# EAGLE schematic outin_shield_ichigojam (EAGLE 7.4.0)
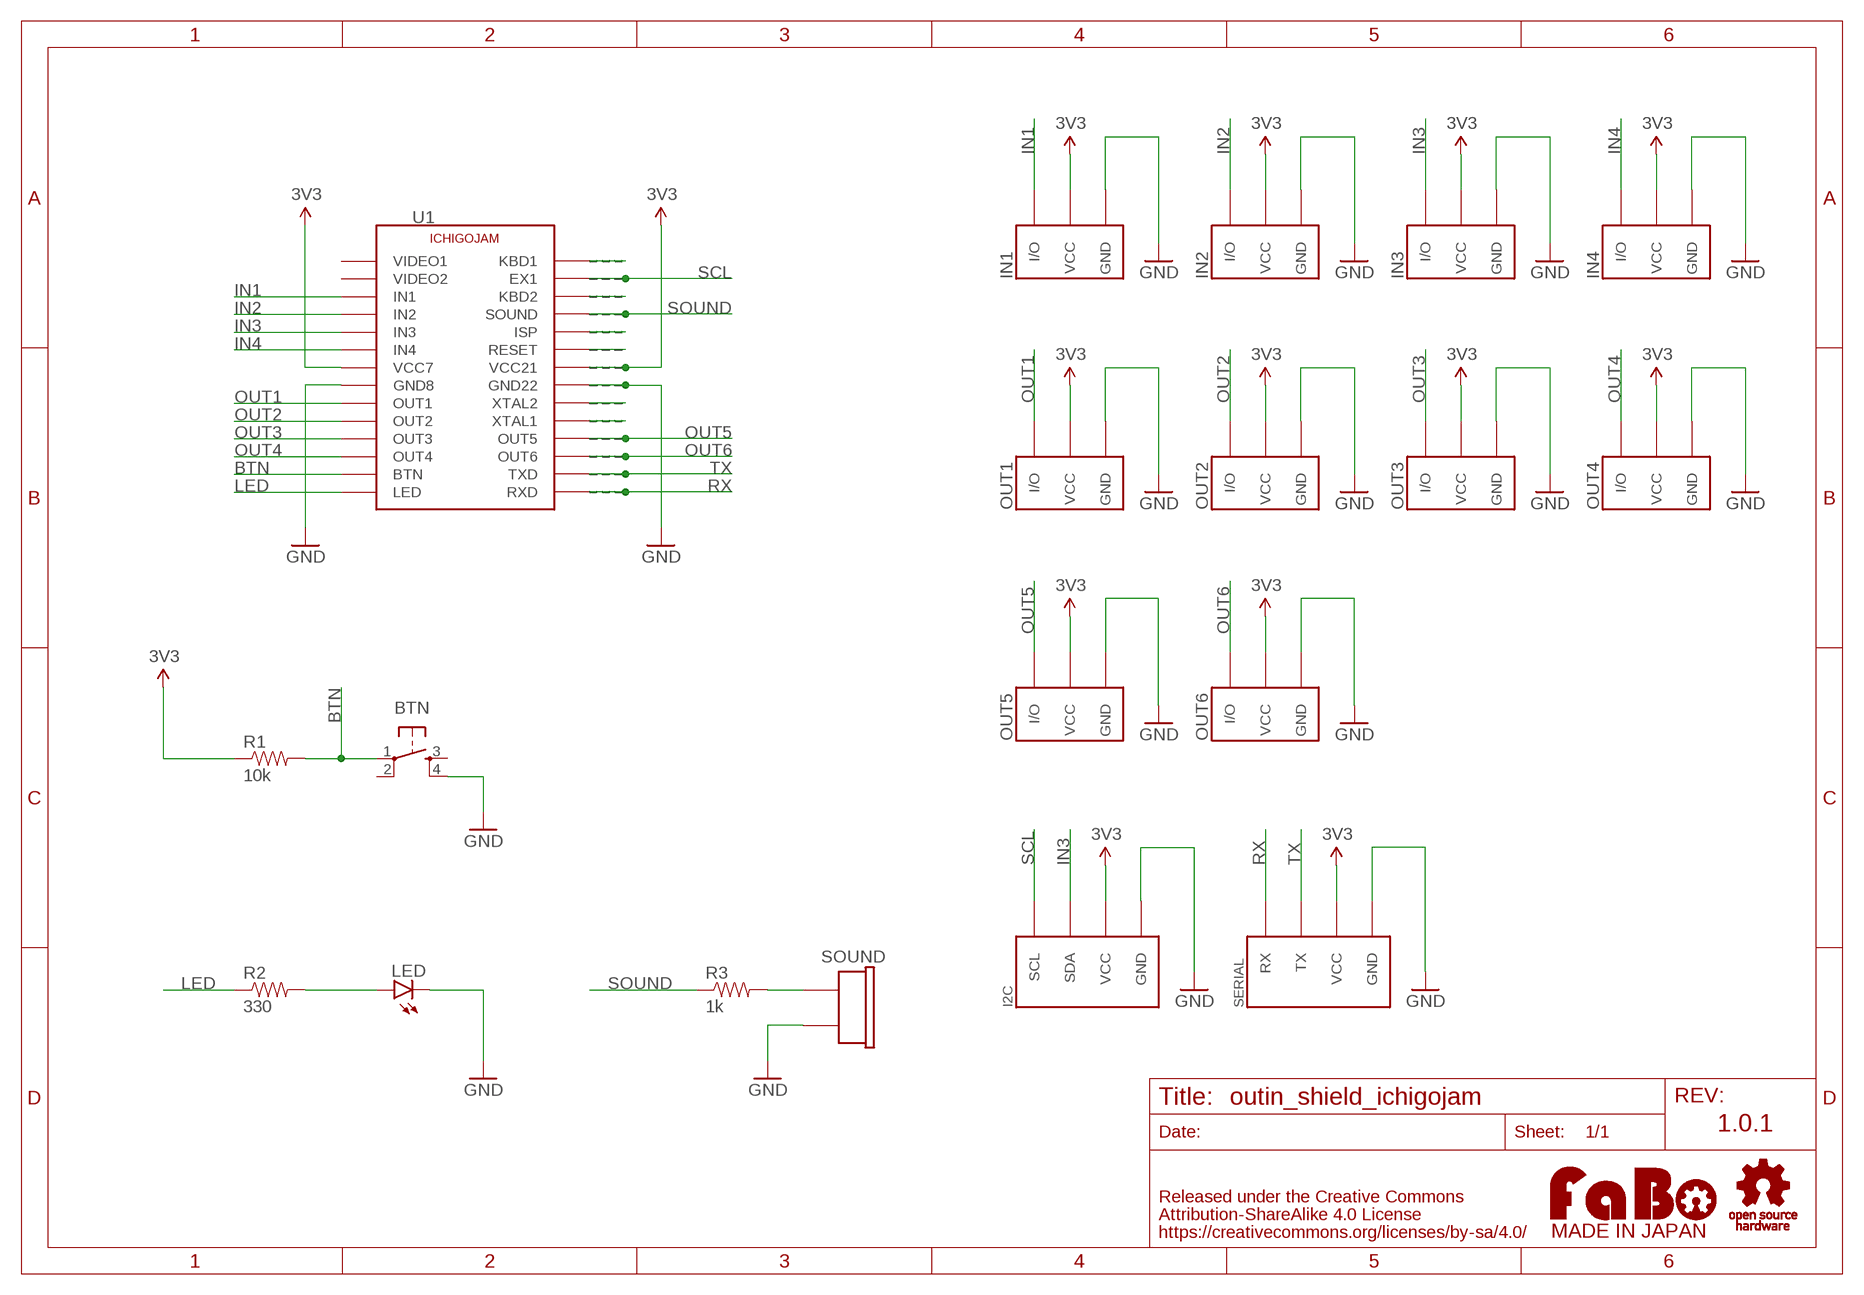
[diagram p0: schematic, sheet 1]

## Parts
BTN  SWITCH-TACT-12MM  [1273HA-160G-G]
I2C  FABO_BRICK_I2C-CONNECTOR  [FABO_BRICK_I2C_CONNECTOR]
IN1  FABO_BRICK_3PIN-CONNECTOR  [FABO_BRICK_3PIN_CONNECTOR]
IN2  FABO_BRICK_3PIN-CONNECTOR  [FABO_BRICK_3PIN_CONNECTOR]
IN3  FABO_BRICK_3PIN-CONNECTOR  [FABO_BRICK_3PIN_CONNECTOR]
IN4  FABO_BRICK_3PIN-CONNECTOR  [FABO_BRICK_3PIN_CONNECTOR]
LED  LED-5MM  [LED-5MM]
OUT1  FABO_BRICK_3PIN-CONNECTOR  [FABO_BRICK_3PIN_CONNECTOR]
OUT2  FABO_BRICK_3PIN-CONNECTOR  [FABO_BRICK_3PIN_CONNECTOR]
OUT3  FABO_BRICK_3PIN-CONNECTOR  [FABO_BRICK_3PIN_CONNECTOR]
OUT4  FABO_BRICK_3PIN-CONNECTOR  [FABO_BRICK_3PIN_CONNECTOR]
OUT5  FABO_BRICK_3PIN-HEADER  [FABO_BRICK_3PIN_HEADER]
OUT6  FABO_BRICK_3PIN-HEADER  [FABO_BRICK_3PIN_HEADER]
R1  10k  RES-PTH-REGULAR  [RES-AXL-REGULAR]
R2  330  RES-PTH-REGULAR  [RES-AXL-REGULAR]
R3  1k  RES-PTH-REGULAR  [RES-AXL-REGULAR]
SERIAL  FABO_BRICK_SERIAL-CONNECTOR  [FABO_BRICK_SERIAL_CONNECTOR]
SOUND  BUZZER-PKM13EPYH4000  [PKM13EPYH4000-A0]
U1  ICHIGOJAM_SHIELD  [ICHIGOJAM_SHIELD_HOLE_DIM]
U$2  LOGO_OSHW-T_M  [LOGO_OSHW_T_M]
U$3  LOGO_FABO-M  [LOGO_FABO_M]

## Nets
3V3: I2C.VCC IN1.VCC IN2.VCC IN3.VCC IN4.VCC OUT1.VCC OUT2.VCC OUT3.VCC OUT4.VCC OUT5.VCC OUT6.VCC R1.P$1 SERIAL.VCC U1.VCC7 U1.VCC21 U1.VCC21-2
BTN: BTN.1 R1.P$2 U1.BTN
GND: BTN.4 I2C.GND IN1.GND IN2.GND IN3.GND IN4.GND LED.K(C) OUT1.GND OUT2.GND OUT3.GND OUT4.GND OUT5.GND OUT6.GND SERIAL.GND SOUND.2 U1.GND8 U1.GND22 U1.GND22-2
IN1: IN1.IN/OUT(I/O) U1.IN1
IN2: IN2.IN/OUT(I/O) U1.IN2
IN3: I2C.SDA IN3.IN/OUT(I/O) U1.IN3
IN4: IN4.IN/OUT(I/O) U1.IN4
LED: R2.P$1 U1.LED
N$2: LED.A R2.P$2
N$4: R3.P$2 SOUND.1
N$13: U1.KBD1 U1.KBD1-2
N$15: U1.KBD2 U1.KBD2-2
N$17: U1.ISP U1.ISP-2
N$18: U1.RESET U1.RESET-2
N$21: U1.XTAL2 U1.XTAL2-2
N$22: U1.XTAL1 U1.XTAL1-2
OUT1: OUT1.IN/OUT(I/O) U1.OUT1
OUT2: OUT2.IN/OUT(I/O) U1.OUT2
OUT3: OUT3.IN/OUT(I/O) U1.OUT3
OUT4: OUT4.IN/OUT(I/O) U1.OUT4
OUT5: OUT5.I/O U1.OUT5 U1.OUT5-2
OUT6: OUT6.I/O U1.OUT6 U1.OUT6-2
RX: SERIAL.RX U1.RXD U1.RXD-2
SCL: I2C.SCL U1.EX1 U1.EX1-2
SOUND: R3.P$1 U1.SOUND U1.SOUND-2
TX: SERIAL.TX U1.TXD U1.TXD-2
Unconnected: BTN.2 BTN.3 U1.VIDEO1 U1.VIDEO2

## Notes on the sheet
- 1.0.1

## Library data of the parts
BTN = FaBo-etc:SWITCH-TACT
I2C = FaBo-Template:FABO_BRICK_I2C: FaBo Brick I2C
IN1-IN4 OUT1-OUT6 = FaBo-Template:FABO_BRICK_3PIN: FaBo Brick 3pin
LED = FaBo-etc:LED: LED
R1-R3 = FaBo-etc:RES
SERIAL = FaBo-Template:FABO_BRICK_SERIAL: FaBo Brick Serial
SOUND = FaBo-etc:BUZZER
U1 = FaBo-Boards:ICHIGOJAM_SHIELD
U$2 = FaBo-etc:LOGO_OSHW
U$3 = FaBo-etc:LOGO_FABO